# Altium schematic sheet Dice RGB - Sht 2.SchDoc: Dice RGB - LED panel
size A4; Organization: PEI; Address1: 22 Russell Crescent; Address2: Western Heights; Address3: Rotorua; Address4: New Zealand 3015; DocumentNumber: N/A; Revision: 0; SheetNumber: 2; SheetTotal: 2
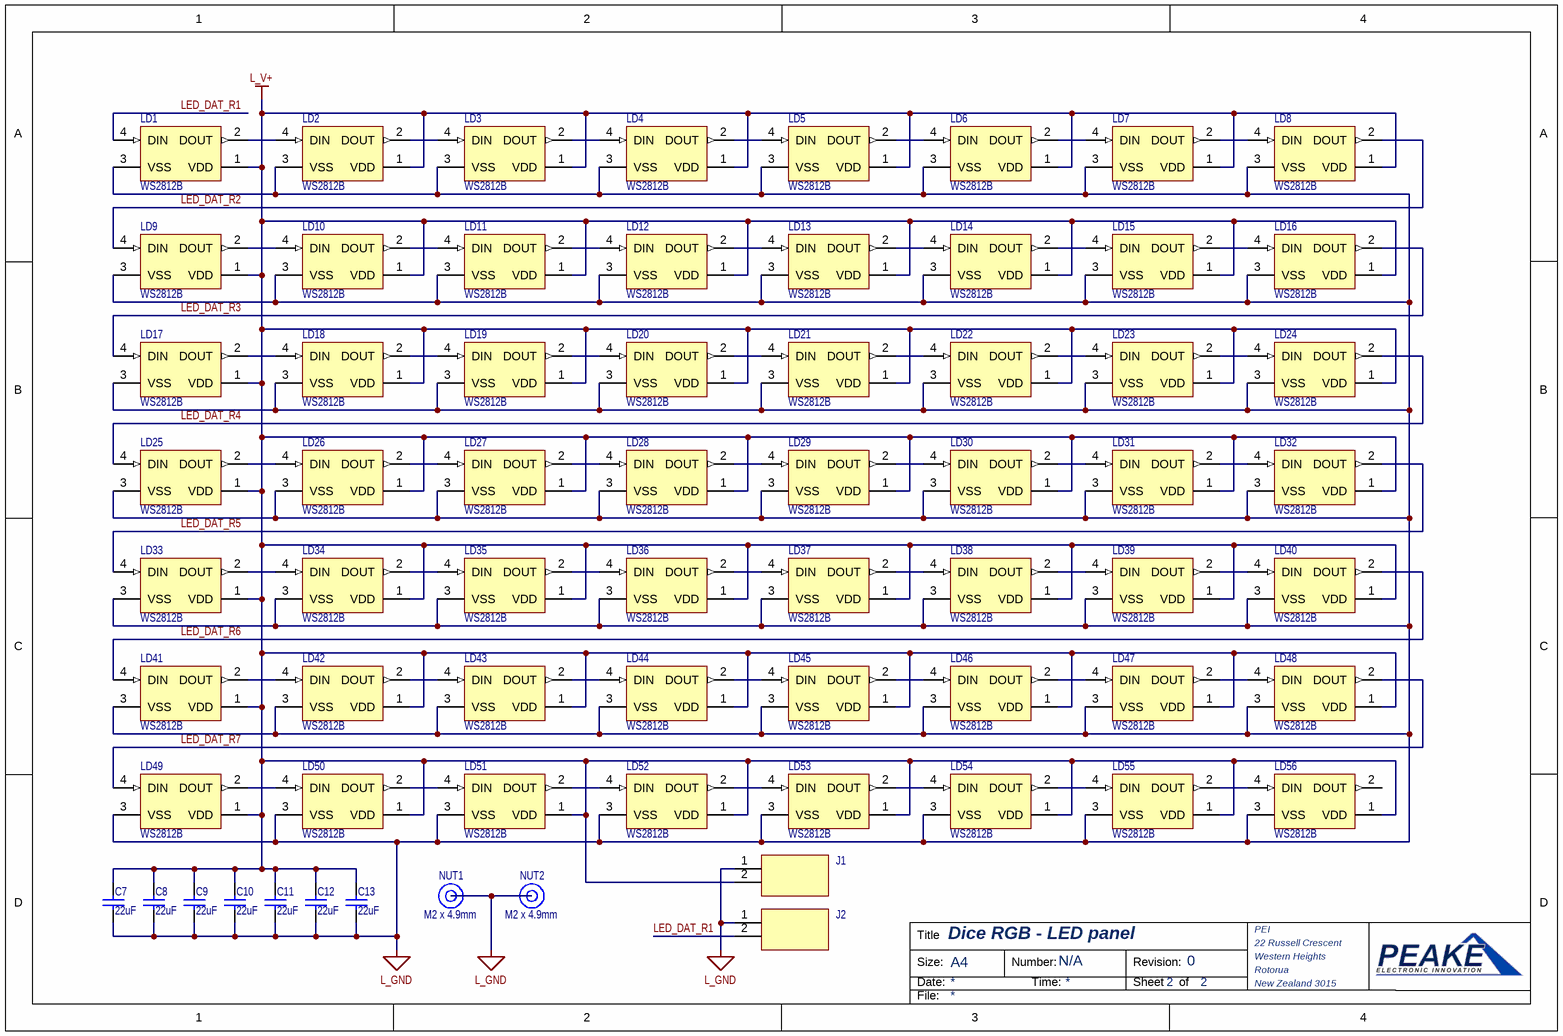
[diagram p0: Dice RGB - Sht 2.SchDoc]

## Parts
C7  value 22uF  [0805_CAP]  (hidden comment: Capacitor)
C8  value 22uF  [0805_CAP]  (hidden comment: Capacitor)
C9  value 22uF  [0805_CAP]  (hidden comment: Capacitor)
C10  value 22uF  [0805_CAP]  (hidden comment: Capacitor)
C11  value 22uF  [0805_CAP]  (hidden comment: Capacitor)
C12  value 22uF  [0805_CAP]  (hidden comment: Capacitor)
C13  value 22uF  [0805_CAP]  (hidden comment: Capacitor)
J1  2_Pin  [2P 2mm SMD dbl height male header]  (value not drawn)
J2  2_Pin  [2P 2mm SMD dbl height male header]  (value not drawn)
LD1  WS2812B  [WS2812B-2020]
LD2  WS2812B  [WS2812B-2020]
LD3  WS2812B  [WS2812B-2020]
LD4  WS2812B  [WS2812B-2020]
LD5  WS2812B  [WS2812B-2020]
LD6  WS2812B  [WS2812B-2020]
LD7  WS2812B  [WS2812B-2020]
LD8  WS2812B  [WS2812B-2020]
LD9  WS2812B  [WS2812B-2020]
LD10  WS2812B  [WS2812B-2020]
LD11  WS2812B  [WS2812B-2020]
LD12  WS2812B  [WS2812B-2020]
LD13  WS2812B  [WS2812B-2020]
LD14  WS2812B  [WS2812B-2020]
LD15  WS2812B  [WS2812B-2020]
LD16  WS2812B  [WS2812B-2020]
LD17  WS2812B  [WS2812B-2020]
LD18  WS2812B  [WS2812B-2020]
LD19  WS2812B  [WS2812B-2020]
LD20  WS2812B  [WS2812B-2020]
LD21  WS2812B  [WS2812B-2020]
LD22  WS2812B  [WS2812B-2020]
LD23  WS2812B  [WS2812B-2020]
LD24  WS2812B  [WS2812B-2020]
LD25  WS2812B  [WS2812B-2020]
LD26  WS2812B  [WS2812B-2020]
LD27  WS2812B  [WS2812B-2020]
LD28  WS2812B  [WS2812B-2020]
LD29  WS2812B  [WS2812B-2020]
LD30  WS2812B  [WS2812B-2020]
LD31  WS2812B  [WS2812B-2020]
LD32  WS2812B  [WS2812B-2020]
LD33  WS2812B  [WS2812B-2020]
LD34  WS2812B  [WS2812B-2020]
LD35  WS2812B  [WS2812B-2020]
LD36  WS2812B  [WS2812B-2020]
LD37  WS2812B  [WS2812B-2020]
LD38  WS2812B  [WS2812B-2020]
LD39  WS2812B  [WS2812B-2020]
LD40  WS2812B  [WS2812B-2020]
LD41  WS2812B  [WS2812B-2020]
LD42  WS2812B  [WS2812B-2020]
LD43  WS2812B  [WS2812B-2020]
LD44  WS2812B  [WS2812B-2020]
LD45  WS2812B  [WS2812B-2020]
LD46  WS2812B  [WS2812B-2020]
LD47  WS2812B  [WS2812B-2020]
LD48  WS2812B  [WS2812B-2020]
LD49  WS2812B  [WS2812B-2020]
LD50  WS2812B  [WS2812B-2020]
LD51  WS2812B  [WS2812B-2020]
LD52  WS2812B  [WS2812B-2020]
LD53  WS2812B  [WS2812B-2020]
LD54  WS2812B  [WS2812B-2020]
LD55  WS2812B  [WS2812B-2020]
LD56  WS2812B  [WS2812B-2020]
NUT1  M2 x 4.9mm  [PCB Nut M2-SMD]
NUT2  M2 x 4.9mm  [PCB Nut M2-SMD]

## Nets
L_GND: C7.1 C8.1 C9.1 C10.1 C11.1 C12.1 C13.1 J1.1(GND) J2.1(GND) LD1.3(VSS) LD2.3(VSS) LD3.3(VSS) LD4.3(VSS) LD5.3(VSS) LD6.3(VSS) LD7.3(VSS) LD8.3(VSS) LD9.3(VSS) LD10.3(VSS) LD11.3(VSS) LD12.3(VSS) LD13.3(VSS) LD14.3(VSS) LD15.3(VSS) LD16.3(VSS) LD17.3(VSS) LD18.3(VSS) LD19.3(VSS) LD20.3(VSS) LD21.3(VSS) LD22.3(VSS) LD23.3(VSS) LD24.3(VSS) LD25.3(VSS) LD26.3(VSS) LD27.3(VSS) LD28.3(VSS) LD29.3(VSS) LD30.3(VSS) LD31.3(VSS) LD32.3(VSS) LD33.3(VSS) LD34.3(VSS) LD35.3(VSS) LD36.3(VSS) LD37.3(VSS) LD38.3(VSS) LD39.3(VSS) LD40.3(VSS) LD41.3(VSS) LD42.3(VSS) LD43.3(VSS) LD44.3(VSS) LD45.3(VSS) LD46.3(VSS) LD47.3(VSS) LD48.3(VSS) LD49.3(VSS) LD50.3(VSS) LD51.3(VSS) LD52.3(VSS) LD53.3(VSS) LD54.3(VSS) LD55.3(VSS) LD56.3(VSS) NUT1.1 NUT2.1
L_V+: C7.2 C8.2 C9.2 C10.2 C11.2 C12.2 C13.2 J1.2(V+) LD1.1(VDD) LD2.1(VDD) LD3.1(VDD) LD4.1(VDD) LD5.1(VDD) LD6.1(VDD) LD7.1(VDD) LD8.1(VDD) LD9.1(VDD) LD10.1(VDD) LD11.1(VDD) LD12.1(VDD) LD13.1(VDD) LD14.1(VDD) LD15.1(VDD) LD16.1(VDD) LD17.1(VDD) LD18.1(VDD) LD19.1(VDD) LD20.1(VDD) LD21.1(VDD) LD22.1(VDD) LD23.1(VDD) LD24.1(VDD) LD25.1(VDD) LD26.1(VDD) LD27.1(VDD) LD28.1(VDD) LD29.1(VDD) LD30.1(VDD) LD31.1(VDD) LD32.1(VDD) LD33.1(VDD) LD34.1(VDD) LD35.1(VDD) LD36.1(VDD) LD37.1(VDD) LD38.1(VDD) LD39.1(VDD) LD40.1(VDD) LD41.1(VDD) LD42.1(VDD) LD43.1(VDD) LD44.1(VDD) LD45.1(VDD) LD46.1(VDD) LD47.1(VDD) LD48.1(VDD) LD49.1(VDD) LD50.1(VDD) LD51.1(VDD) LD52.1(VDD) LD53.1(VDD) LD54.1(VDD) LD55.1(VDD) LD56.1(VDD)
LED_DAT_R1: J2.2(DAT) LD1.4(DIN)
LED_DAT_R2: LD8.2(DOUT) LD9.4(DIN)
LED_DAT_R3: LD16.2(DOUT) LD17.4(DIN)
LED_DAT_R4: LD24.2(DOUT) LD25.4(DIN)
LED_DAT_R5: LD32.2(DOUT) LD33.4(DIN)
LED_DAT_R6: LD40.2(DOUT) LD41.4(DIN)
LED_DAT_R7: LD48.2(DOUT) LD49.4(DIN)
NetLD1_2: LD1.2(DOUT) LD2.4(DIN)
NetLD2_2: LD2.2(DOUT) LD3.4(DIN)
NetLD3_2: LD3.2(DOUT) LD4.4(DIN)
NetLD4_2: LD4.2(DOUT) LD5.4(DIN)
NetLD5_2: LD5.2(DOUT) LD6.4(DIN)
NetLD6_2: LD6.2(DOUT) LD7.4(DIN)
NetLD7_2: LD7.2(DOUT) LD8.4(DIN)
NetLD9_2: LD9.2(DOUT) LD10.4(DIN)
NetLD10_2: LD10.2(DOUT) LD11.4(DIN)
NetLD11_2: LD11.2(DOUT) LD12.4(DIN)
NetLD12_2: LD12.2(DOUT) LD13.4(DIN)
NetLD13_2: LD13.2(DOUT) LD14.4(DIN)
NetLD14_2: LD14.2(DOUT) LD15.4(DIN)
NetLD15_2: LD15.2(DOUT) LD16.4(DIN)
NetLD17_2: LD17.2(DOUT) LD18.4(DIN)
NetLD18_2: LD18.2(DOUT) LD19.4(DIN)
NetLD19_2: LD19.2(DOUT) LD20.4(DIN)
NetLD20_2: LD20.2(DOUT) LD21.4(DIN)
NetLD21_2: LD21.2(DOUT) LD22.4(DIN)
NetLD22_2: LD22.2(DOUT) LD23.4(DIN)
NetLD23_2: LD23.2(DOUT) LD24.4(DIN)
NetLD25_2: LD25.2(DOUT) LD26.4(DIN)
NetLD26_2: LD26.2(DOUT) LD27.4(DIN)
NetLD27_2: LD27.2(DOUT) LD28.4(DIN)
NetLD28_2: LD28.2(DOUT) LD29.4(DIN)
NetLD29_2: LD29.2(DOUT) LD30.4(DIN)
NetLD30_2: LD30.2(DOUT) LD31.4(DIN)
NetLD31_2: LD31.2(DOUT) LD32.4(DIN)
NetLD33_2: LD33.2(DOUT) LD34.4(DIN)
NetLD34_2: LD34.2(DOUT) LD35.4(DIN)
NetLD35_2: LD35.2(DOUT) LD36.4(DIN)
NetLD36_2: LD36.2(DOUT) LD37.4(DIN)
NetLD37_2: LD37.2(DOUT) LD38.4(DIN)
NetLD38_2: LD38.2(DOUT) LD39.4(DIN)
NetLD39_2: LD39.2(DOUT) LD40.4(DIN)
NetLD41_2: LD41.2(DOUT) LD42.4(DIN)
NetLD42_2: LD42.2(DOUT) LD43.4(DIN)
NetLD43_2: LD43.2(DOUT) LD44.4(DIN)
NetLD44_2: LD44.2(DOUT) LD45.4(DIN)
NetLD45_2: LD45.2(DOUT) LD46.4(DIN)
NetLD46_2: LD46.2(DOUT) LD47.4(DIN)
NetLD47_2: LD47.2(DOUT) LD48.4(DIN)
NetLD49_2: LD49.2(DOUT) LD50.4(DIN)
NetLD50_2: LD50.2(DOUT) LD51.4(DIN)
NetLD51_2: LD51.2(DOUT) LD52.4(DIN)
NetLD52_2: LD52.2(DOUT) LD53.4(DIN)
NetLD53_2: LD53.2(DOUT) LD54.4(DIN)
NetLD54_2: LD54.2(DOUT) LD55.4(DIN)
NetLD55_2: LD55.2(DOUT) LD56.4(DIN)

Not connected (* = marked no-connect by the designer): LD56 2(DOUT)

## Notes on the sheet
- Title
- Size:
- Date:
- A4
- Number:
- Time:
- Revision:
- Sheet
- of
- File:

## Library data of the parts
C7-C13 = CMP-001-00083-1: SMD Capacitor; Pins: 2; Source: Discrete.SchLib; Component Type: Standard; Design Item ID: Capacitor
J1 J2 = CMP-002-00074-4: 2 Pin Connector; Source: Connectors.SchLib; Pins: 2; Component Type: Standard; Design Item ID: 2_Pin; MFN: *
LD1-LD56 = CMP-007-00035-3: Intelligent Control LED Integrated Light Source, 3.5 to 5.3 V, -25 to 80 degC, 4-Pin SMD, RoHS, Bulk; Manufacturer: Adafruit Industries; Datasheet Version: May-13; Datasheet URL: https://cdn-shop.adafruit.com/datasheets/WS2812B.pdf; Manufacturer URL: https://www.adafruit.com/; Mounting Technology: SM; Case/Package: WS2812B; Package Description: 4-Pin Surface Mount Device, Body 5 x 5 mm, Pitch 3.3 mm; Package Reference: WS2812B; RoHS Compliant: False
NUT1 NUT2 = CMP-00059-1: SMD or through hole soldered PCB nut; Thread: M2 x 0.4; MFN: SMTWE2035MTJ; Length: 4.9mm; Mount style: SMD